# EasyEDA Pro project ProPrj_esp32天气时钟与SD卡MP3播放_2026-06-30.epro

# Schematic Schematic1
Create Date: 2023-12-25; Page Name: P1; Project Name: esp32天气时钟与SD卡MP3播放; Schematic Name: Schematic1; Update Date: 2023-12-25; Company: 嘉立创EDA; Page Size: A4; Version: V1.0
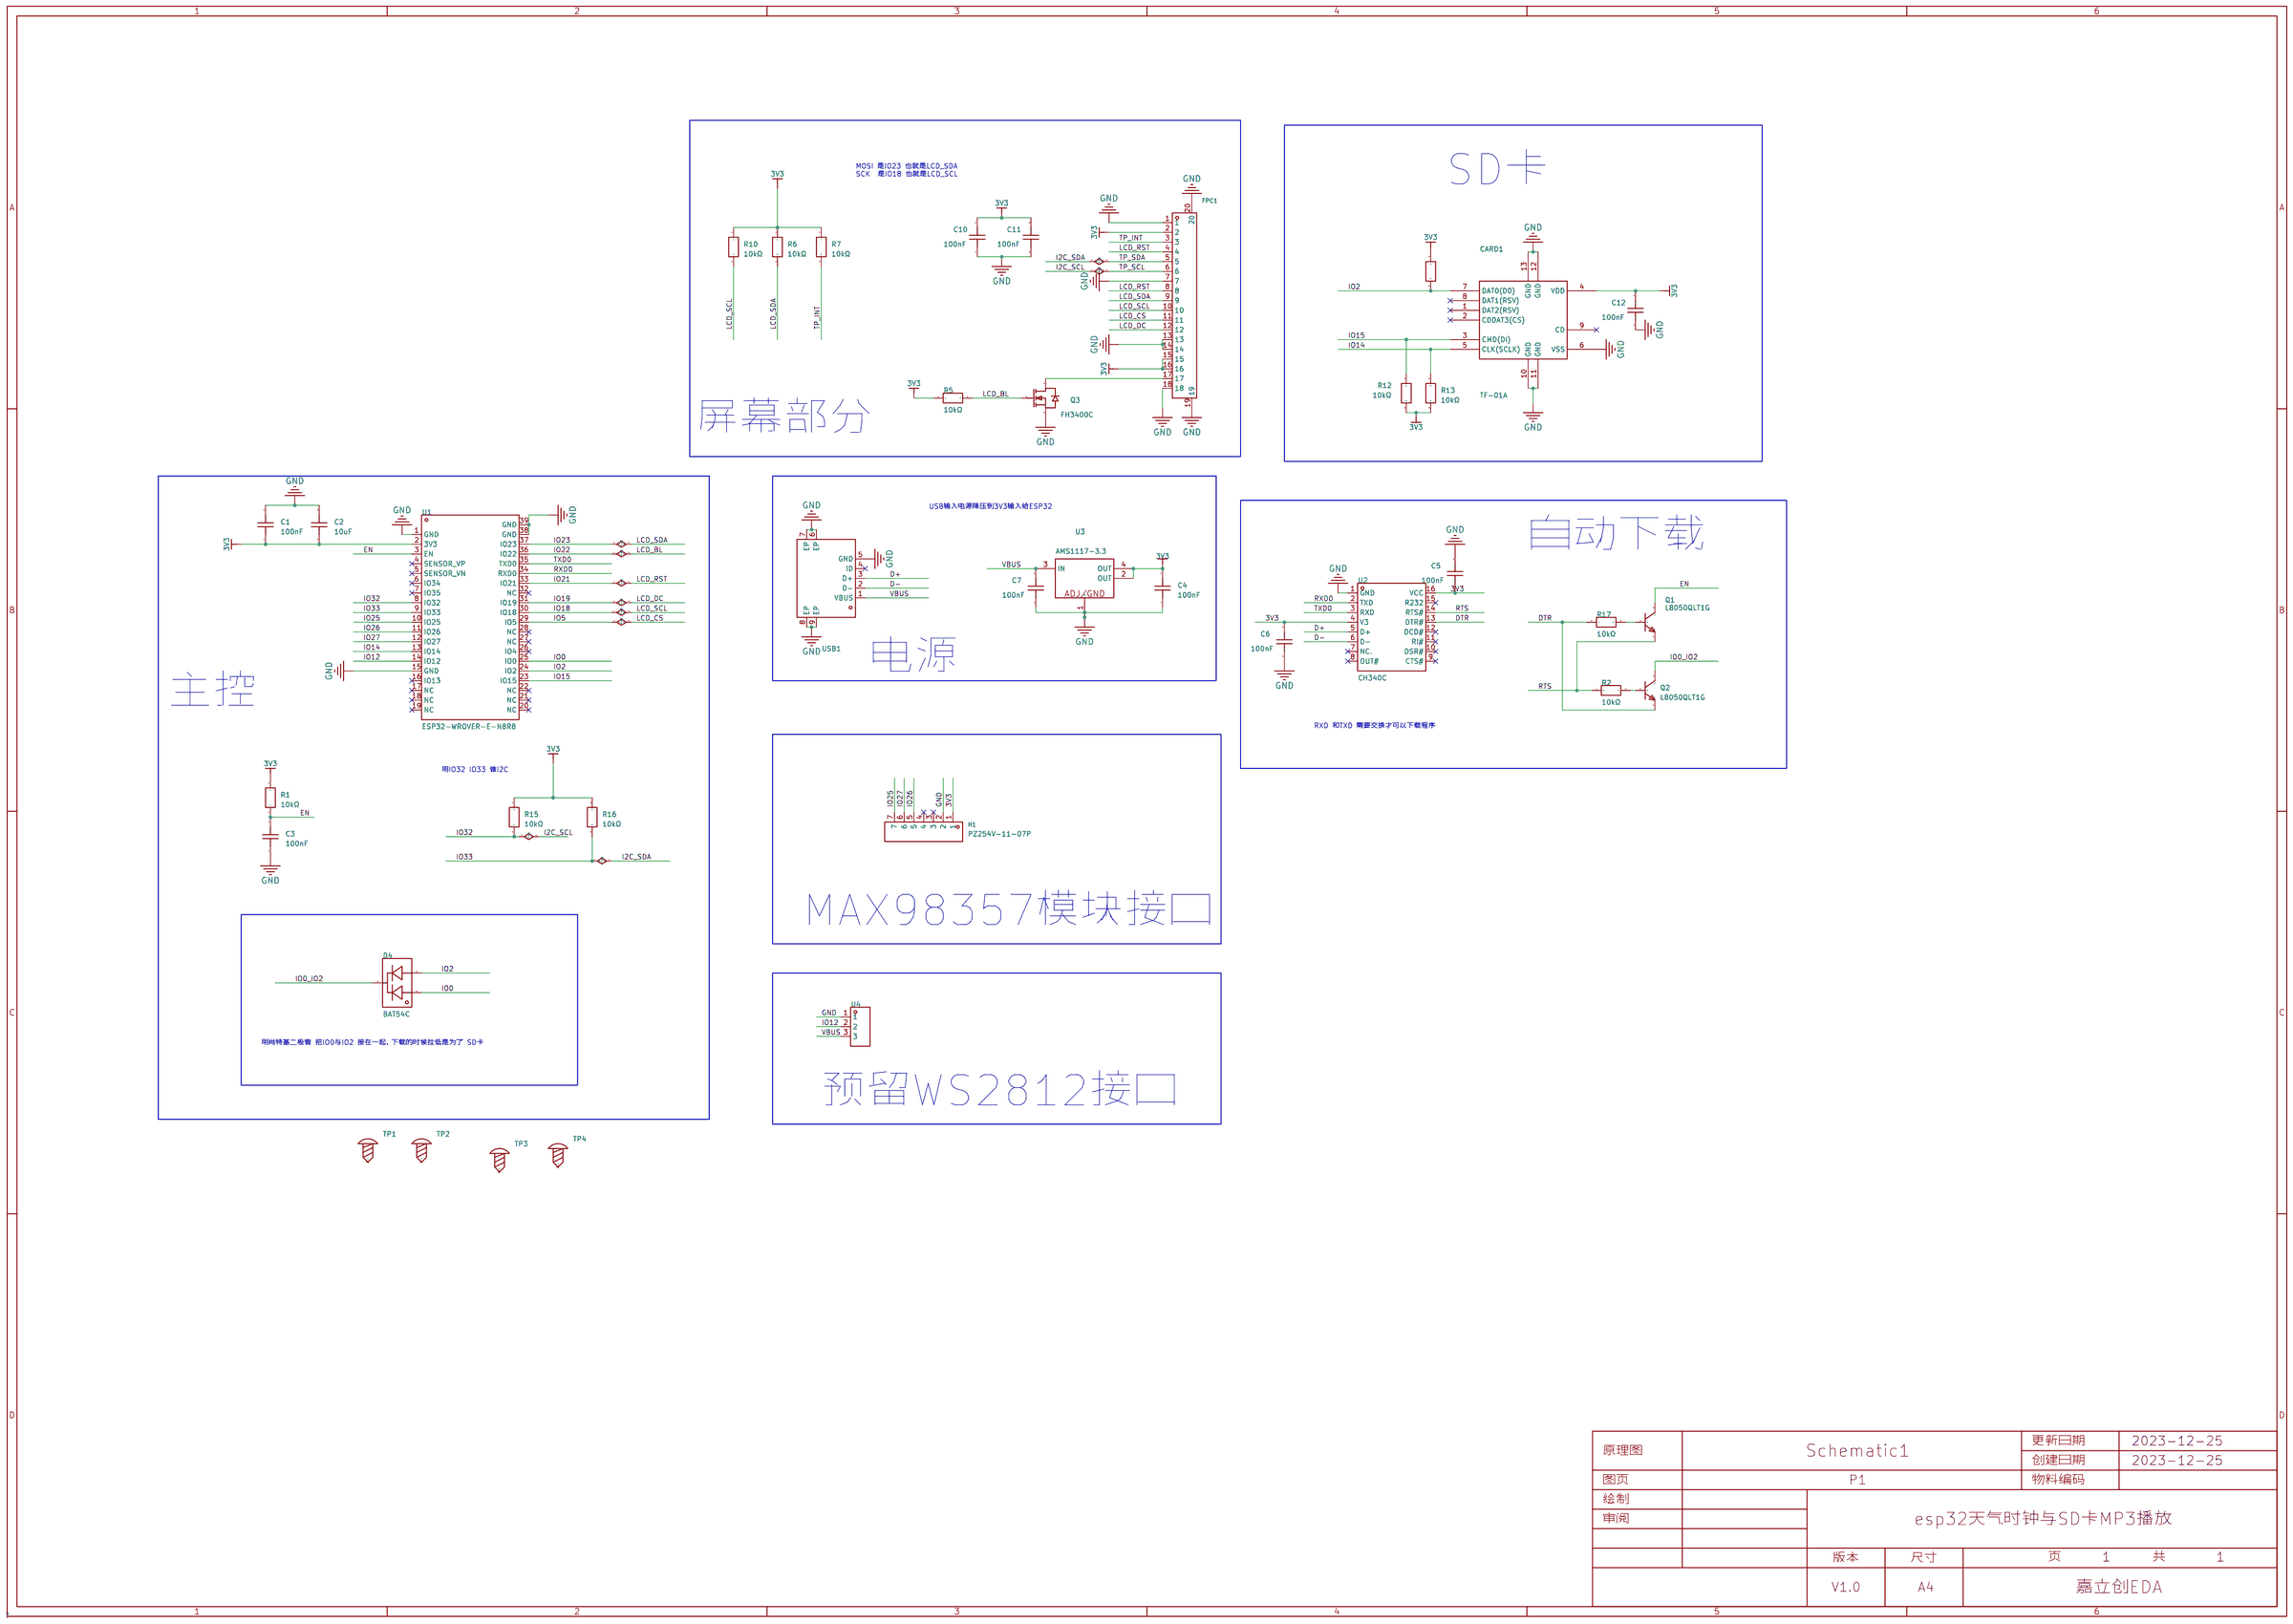
[diagram p0: schematic sheet]

## Parts
C1  100nF  [C0603]
C2  10uF  [C0603]
C3  100nF  [C0603]
C4  100nF  [C0603]
C5  100nF  [C0603]
C6  100nF  [C0603]
C7  100nF  [C0603]
C10  100nF  [C0603]
C11  100nF  [C0603]
C12  100nF  [C0603]
CARD1  TF-01A  [TF-SMD_TF-01A]
D4  BAT54C  [SOT-23-3_L2.9-W1.4-P1.91-LS2.6-BR]
FPC1  X05A15L18T  [FFC-SMD_18P-P0.50_X05A15L18T]
H1  PZ254V-11-07P  [HDR-TH_7P-P2.54-V-M]
Q1  L8050QLT1G  [SOT-23-3_L2.9-W1.3-P1.90-LS2.4-BR]
Q2  L8050QLT1G  [SOT-23-3_L2.9-W1.3-P1.90-LS2.4-BR]
Q3  FH3400C  [SOT-23-3_L2.9-W1.3-P1.90-LS2.4-BR]
R1  10kΩ  [R0805]
R2  10kΩ  [R0805]
R5  10kΩ  [R0805]
R6  10kΩ  [R0805]
R7  10kΩ  [R0805]
R10  10kΩ  [R0805]
R11  10kΩ  [R0805]
R12  10kΩ  [R0805]
R13  10kΩ  [R0805]
R15  10kΩ  [R0805]
R16  10kΩ  [R0805]
R17  10kΩ  [R0805]
TP1  -  [M3螺丝]
TP2  -  [M3螺丝]
TP3  -  [M3螺丝]
TP4  -  [M3螺丝]
U1  ESP32-WROVER-E-N8R8  [WIFI-SMD_ESP32-WROVER-IE8MB]
U2  CH340C  [SOP-16_L10.0-W3.9-P1.27-LS6.0-BL]
U3  AMS1117-3.3  [SOT-223-3_L6.4-W3.5-P2.30-LS7.0-BR]
U4  HDGC2001WR-3P  [CONN-TH_3P-P2.00_HDGC_HDGC2001WR-3P]
USB1  U-F-M5DD-Y-2  [MICRO-USB-SMD_U-F-M5DD-Y-2-1]

## Library data of the parts
C1 C3 = CL10B104KB8NNNC: 容值:100nF;精度:±10%;额定电压:50V;材质(温度系数):X7R;; LCSC Part Name: 100nF ±10% 50V; Supplier Part: C1591; Manufacturer: SAMSUNG(三星); Supplier Footprint: 0603; Datasheet: https://atta.szlcsc.com/upload/public/pdf/source/20160218/1457707763339.pdf; Supplier: LCSC; Tolerance: ±10%; Voltage Rated: 50V; Temperature Coefficient: X7R
C2 = CL10A106MQ8NNNC: 容值:10uF;精度:±20%;额定电压:6.3V;材质(温度系数):X5R;; LCSC Part Name: 10uF ±20% 6.3V; Supplier Part: C1691; Manufacturer: SAMSUNG(三星); Supplier Footprint: 0603; Datasheet: https://atta.szlcsc.com/upload/public/pdf/source/20160218/1457707763339.pdf; Supplier: LCSC; Tolerance: ±20%; Voltage Rated: 6.3V; Temperature Coefficient: X5R
C4-C7 C10-C12 = CC0603KRX7R9BB104: 容值:100nF;精度:±10%;额定电压:50V;材质(温度系数):X7R;; LCSC Part Name: 100nF ±10% 50V; Supplier Part: C14663; Manufacturer: YAGEO(国巨); Supplier Footprint: 0603; JLCPCB Part Class: Basic Part; Datasheet: https://atta.szlcsc.com/upload/public/pdf/source/20170116/1484561234239.pdf; Supplier: LCSC; Tolerance: ±10%; Voltage Rated: 50V; Temperature Coefficient: X7R
CARD1 = TF-01A_C91145: 工作温度范围:-;本体最大高度:-;触头镀层:-;连接器类型:卡座;卡类型:MicroSD卡(TF卡);焊接温度(最大值):-;触头材质:-;卡连接方式:自弹式;; Supplier Part: C91145; Manufacturer: 韩国韩荣; Supplier Footprint: SMD; Datasheet: https://atta.szlcsc.com/upload/public/pdf/source/20190322/C91145_63CBD6FB4639A3A3EC6A9721F18AE0FB.pdf; Supplier: LCSC; Connector Type: 卡座; Card Type: MicroSD卡(TF卡); Card Connection Mode: 自弹式
D4 = BAT54C_C727125: 二极管配置:1对共阴极;直流反向耐压(Vr):30V;平均整流电流(Io):200mA;正向压降(Vf):1V@100mA;反向电流(Ir):2uA@25V;; LCSC Part Name: 30V 200mA 1V@100mA; Supplier Part: C727125; Manufacturer: TWGMC(台湾迪嘉); Supplier Footprint: SOT-23; Datasheet: https://atta.szlcsc.com/upload/public/pdf/source/20200827/C727125_FA9D830E6485A4AEFAD08726CE8D43AC.pdf; Supplier: LCSC; Diode Configuration: 1对共阴极; Reverse Voltage (Vr): 30V; Average Rectified Current (Io): 200mA; Forward Voltage (Vf@If): 1V@100mA; Reverse Leakage Current (Ir): 2uA@25V
FPC1 = X05A15L18T: 间距:0.5mm;触点数量:18;锁定特性:翻盖式;安装类型:卧贴;触点类型:下接;工作温度范围:-25℃~+85℃;焊接温度(最大值):260℃;; LCSC Part Name: 0.5mm P数:18 翻盖式 下接 镀锡; Supplier Part: C437037; Manufacturer: XKB Connectivity(中国星坤); Supplier Footprint: SMD,P=0.5mm; Supplier: LCSC; Pitch: 0.5mm; Number of Contacts: 18; Locking Feature: 翻盖式; Mounting Type: 卧贴; Contact Type: 下接; Height Above Board: 1.5mm; FFC, FCB Thickness: 0.3mm; Contact Material: 铜合金; Contact Plating: 锡; Operating Temperature Range: -25℃~+85℃; Welding Temperature (Max): 260℃
H1 = PZ254V-11-07P: 排数:单排;总PIN位数:7P;间距:2.54mm;插针结构:1x7P;行距:-;安装类型:直插;圆针/方针:方针;额定电流:-;额定电压:-;配合针长度:6mm;塑高:2.5mm;端接针长度:3mm;触头材质:黄铜;触头镀层:-;工作温度范围:-40℃~+105℃;颜色:黑色;; LCSC Part Name: 2.54mm 1x7P 直插 方针; Supplier Part: C492406; Manufacturer: XFCN(兴飞); Supplier Footprint: 插件,P=2.54mm; JLCPCB Part Class: 扩展库; Datasheet: https://atta.szlcsc.com/upload/public/pdf/source/20200309/C492406_654C533EE691117E22DD9F76C114C2D9.pdf; Supplier: LCSC; Number of Rows: 单排; Number of Pins: 7P; Pitch: 2.54mm; Pin Structure: 1x7P; Mounting Type: 直插; Circluar Pins/Square Pins: 方针; Length of Mating Pin: 6mm; Insulation Height: 2.5mm; Length of End Connection Pin: 3mm; Contact Material: 黄铜; Operating Temperature Range: -40℃~+105℃; Color: 黑色
Q1 Q2 = L8050QLT1G: 晶体管类型:NPN;集射极击穿电压(Vceo):25V;集电极电流(Ic):800mA;功率(Pd):225mW;; LCSC Part Name: NPN 耐压:25V 电流:800mA; Supplier Part: C49581; Manufacturer: LRC(乐山无线电); Supplier Footprint: SOT-23; Datasheet: https://atta.szlcsc.com/upload/public/pdf/source/20150518/1457707314424.pdf; Supplier: LCSC; Transistor Type: NPN; Collector-Emitter Breakdown Voltage (Vceo): 25V; Collector Current (Ic): 800mA; Power Dissipation (Pd): 225mW
Q3 = FH3400C: LCSC Part Name: NMOS; Supplier Part: C2940037; Manufacturer: 鑫飞宏; Supplier Footprint: SOT-23; Datasheet: https://atta.szlcsc.com/upload/public/pdf/source/20220104/F9C168DB7EB2E0C5477F24B8ADDCAFBA.pdf; Supplier: LCSC
R1 R2 R5-R7 R10-R13 R15-R17 = FRC0805J103TS: 阻值:10kΩ;精度:±5%;功率:125mW;温度系数:±100ppm/℃;电阻类型:厚膜电阻;; LCSC Part Name: 10kΩ ±5% 125mW 厚膜电阻; Supplier Part: C2930231; Manufacturer: FOJAN(富捷); Supplier Footprint: 0805; Datasheet: https://atta.szlcsc.com/upload/public/pdf/source/20211221/925EC7D7225764EE0046F22065062C87.pdf; Supplier: LCSC; Tolerance: ±5%; Power(Watts): 125mW; Overload Voltage (Max): 150V; Temperature Coefficient: ±100ppm/℃; Type: 厚膜电阻; Operating Temperature Range: -55℃~+155℃
TP1-TP4 = M3螺丝: Supplier Footprint: 插件
U1 = ESP32-WROVER-E-N8R8: LCSC Part Name: 通用型Wi-Fi+BT+BLE MCU模组; Supplier Part: C2973667; Manufacturer: ESPRESSIF(乐鑫); Supplier Footprint: SMD,18x31.4mm; JLCPCB Part Class: 扩展库; Datasheet: https://atta.szlcsc.com/upload/public/pdf/source/20220705/4CA9CAE4F1CD09508C2EE2DEF6FA5017.pdf; Supplier: LCSC
U2 = CH340C: 应用功能:收发器;接口协议:USB 2.0;数据速率:2Mbps;; LCSC Part Name: CH340C USB转串口芯片 CH340; Supplier Part: C84681; Manufacturer: WCH(南京沁恒); Supplier Footprint: SOP-16; Datasheet: https://atta.szlcsc.com/upload/public/pdf/source/20200819/C84681_ADBED554CE321879DBD6B1D06488689C.pdf; Supplier: LCSC; Applications Function: 收发器; Protocol: USB 2.0; Data Rate: 2Mbps; Supply Voltage: 3.3V；5V
U3 = AMS1117-3.3_C2992570: Supplier Part: C2992570; Manufacturer: 国芯佳品; Supplier Footprint: SOT-223-3; JLCPCB Part Class: Extended Part; Datasheet: https://atta.szlcsc.com/upload/public/pdf/source/20220729/0D21C21EC310E4778671BF6BAE438640.pdf; Supplier: LCSC
U4 = HDGC2001WR-3P: LCSC Part Name: PH2.0弯针 3P; Supplier Part: C5175240; Manufacturer: HDGC(华德共创); Supplier Footprint: 弯插,P=2mm; JLCPCB Part Class: 扩展库; Datasheet: https://atta.szlcsc.com/upload/public/pdf/source/20220916/36534CA64A2134C65DEF28B604EC5CCB.pdf; Supplier: LCSC
USB1 = U-F-M5DD-Y-2: 连接器类型:Micro-B;标准:USB 2.0;公母:母;触点数量:5P;端口数量:1;安装方式:卧贴;额定电流 - 电源:1A;工作温度范围:-;; LCSC Part Name: Micro-B 母 卧贴; Supplier Part: C2689949; Manufacturer: 韩国韩荣; Supplier Footprint: SMD; Datasheet: https://atta.szlcsc.com/upload/public/pdf/source/20210322/C2689949_86876C80FB813C0122F4FEFC65AEF6C8.pdf; Supplier: LCSC; Connector Type: Micro-B; Standard: USB 2.0; Gender: 母; Number of Contacts: 5P; Number of Ports: 1; Mounting Style: 卧贴; Current Rating - Power (Max): 1A

## Nets
3V3: C1.1 C2.1 C4.2 C5.1 C6.2 C10.2 C11.2 C12.2 CARD1.4(VDD) FPC1.2 FPC1.15 FPC1.16 H1.1 R1.2 R5.2 R6.1 R7.1 R10.1 R11.1 R12.2 R13.2 R15.1 R16.1 U1.2(3V3) U2.4(V3) U2.16(VCC) U3.2(OUT) U3.4(OUT)
GND: C1.2 C2.2 C3.1 C4.1 C5.2 C6.1 C7.1 C10.1 C11.1 C12.1 CARD1.6(VSS) CARD1.10(GND) CARD1.11(GND) CARD1.12(GND) CARD1.13(GND) FPC1.1 FPC1.7 FPC1.13 FPC1.14 FPC1.18 FPC1.19 FPC1.20 H1.2 Q3.2(S) U1.1(GND) U1.15(GND) U1.38(GND) U1.39(GND) U2.1(GND) U3.1(ADJ/GND) U4.1 USB1.5(GND) USB1.6(EP) USB1.7(EP) USB1.8(EP) USB1.9(EP)
VBUS: C7.2 U3.3(IN) U4.3 USB1.1(VBUS)
D+: U2.5(D+) USB1.3(D+)
D-: U2.6(D-) USB1.2(D-)
DTR: Q2.2(E) R17.1 U2.13(DTR#)
EN: C3.2 Q1.3(C) R1.1 U1.3(EN)
I2C_SCL: FPC1.6 R15.2 U1.8(IO32)
I2C_SDA: FPC1.5 R16.2 U1.9(IO33)
IO0: D4.1 U1.25(IO0)
IO0_IO2: D4.3 Q2.3(C)
IO2: CARD1.7(DAT0(D0)) D4.2 R11.2 U1.24(IO2)
IO5: FPC1.11 U1.29(IO5)
IO12: U1.14(IO12) U4.2
IO14: CARD1.5(CLK(SCLK)) R13.1 U1.13(IO14)
IO15: CARD1.3(CMD(DI)) R12.1 U1.23(IO15)
IO18: FPC1.10 R10.2 U1.30(IO18)
IO19: FPC1.12 U1.31(IO19)
IO21: FPC1.4 FPC1.8 U1.33(IO21)
IO22: Q3.1(G) R5.1 U1.36(IO22)
IO23: FPC1.9 R6.2 U1.37(IO23)
IO25: H1.7 U1.10(IO25)
IO26: H1.5 U1.11(IO26)
IO27: H1.6 U1.12(IO27)
RTS: Q1.2(E) R2.1 U2.14(RTS#)
RXD0: U1.34(RXD0) U2.2(TXD)
TP_INT: FPC1.3 R7.2
TXD0: U1.35(TXD0) U2.3(RXD)
$1N3592: Q1.1(B) R17.2
$1N3593: Q2.1(B) R2.2
$1N3615: FPC1.17 Q3.3(D)

Not connected (* = marked no-connect by the designer): CARD1 1(DAT2(RSV))* 2(CDDAT3(CS))* 8(DAT1(RSV))* 9(CD)*; H1 3* 4*; TP1 1; TP2 1; TP3 1; TP4 1; U1 4(SENSOR_VP)* 5(SENSOR_VN)* 6(IO34)* 7(IO35)* 16(IO13)* 17(NC)* 18(NC)* 19(NC)* 20(NC)* 21(NC)* 22(NC)* 26(IO4)* 27(NC)* 28(NC)* 32(NC)*; U2 7(NC.)* 8(OUT#)* 9(CTS#)* 10(DSR#)* 11(RI#)* 12(DCD#)* 15(R232)*; USB1 4(ID)*

## Notes on the sheet
- MOSI 是IO23 也就是LCD_SDA
  SCK  是IO18 也就是LCD_SCL
- SD卡
- 屏幕部分
- USB输入电源降压到3V3输入给ESP32
- 自动下载
- 电源
- 主控
- RXD 和TXD 需要交换才可以下载程序
- 用IO32 IO33 做I2C
- MAX98357模块接口
- 用肖特基二极管 把IO0与IO2 接在一起，下载的时候拉低是为了 SD卡
- 预留WS2812接口

# Board PCB1_3
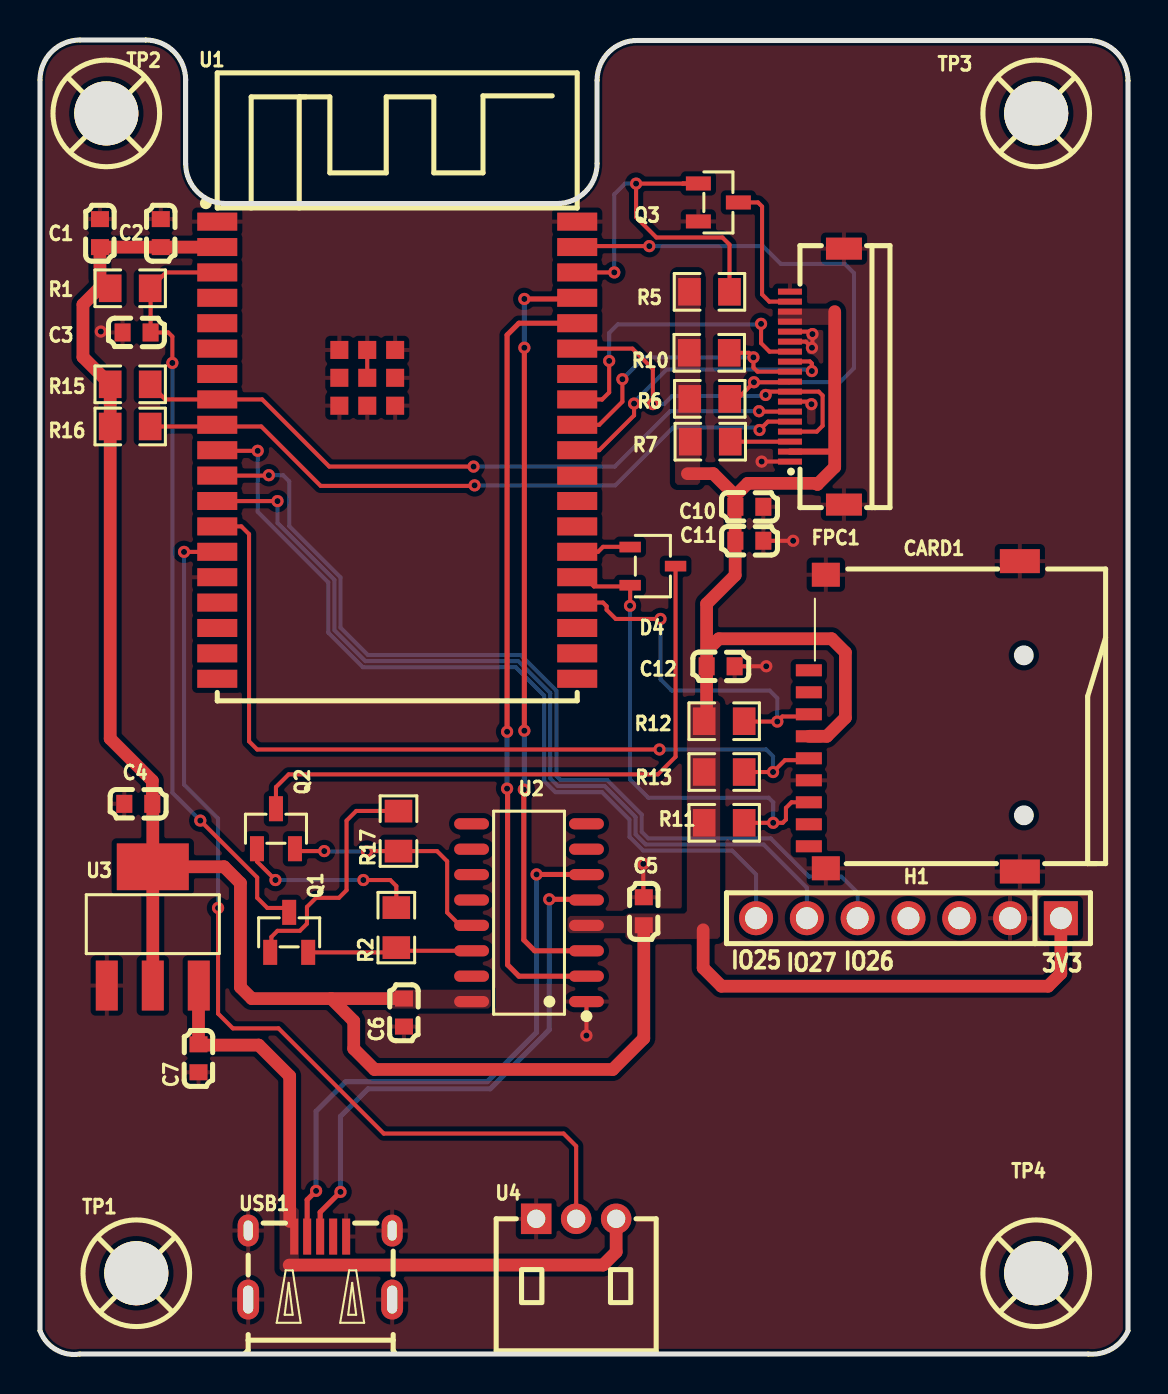
[diagram p1: board, top side]
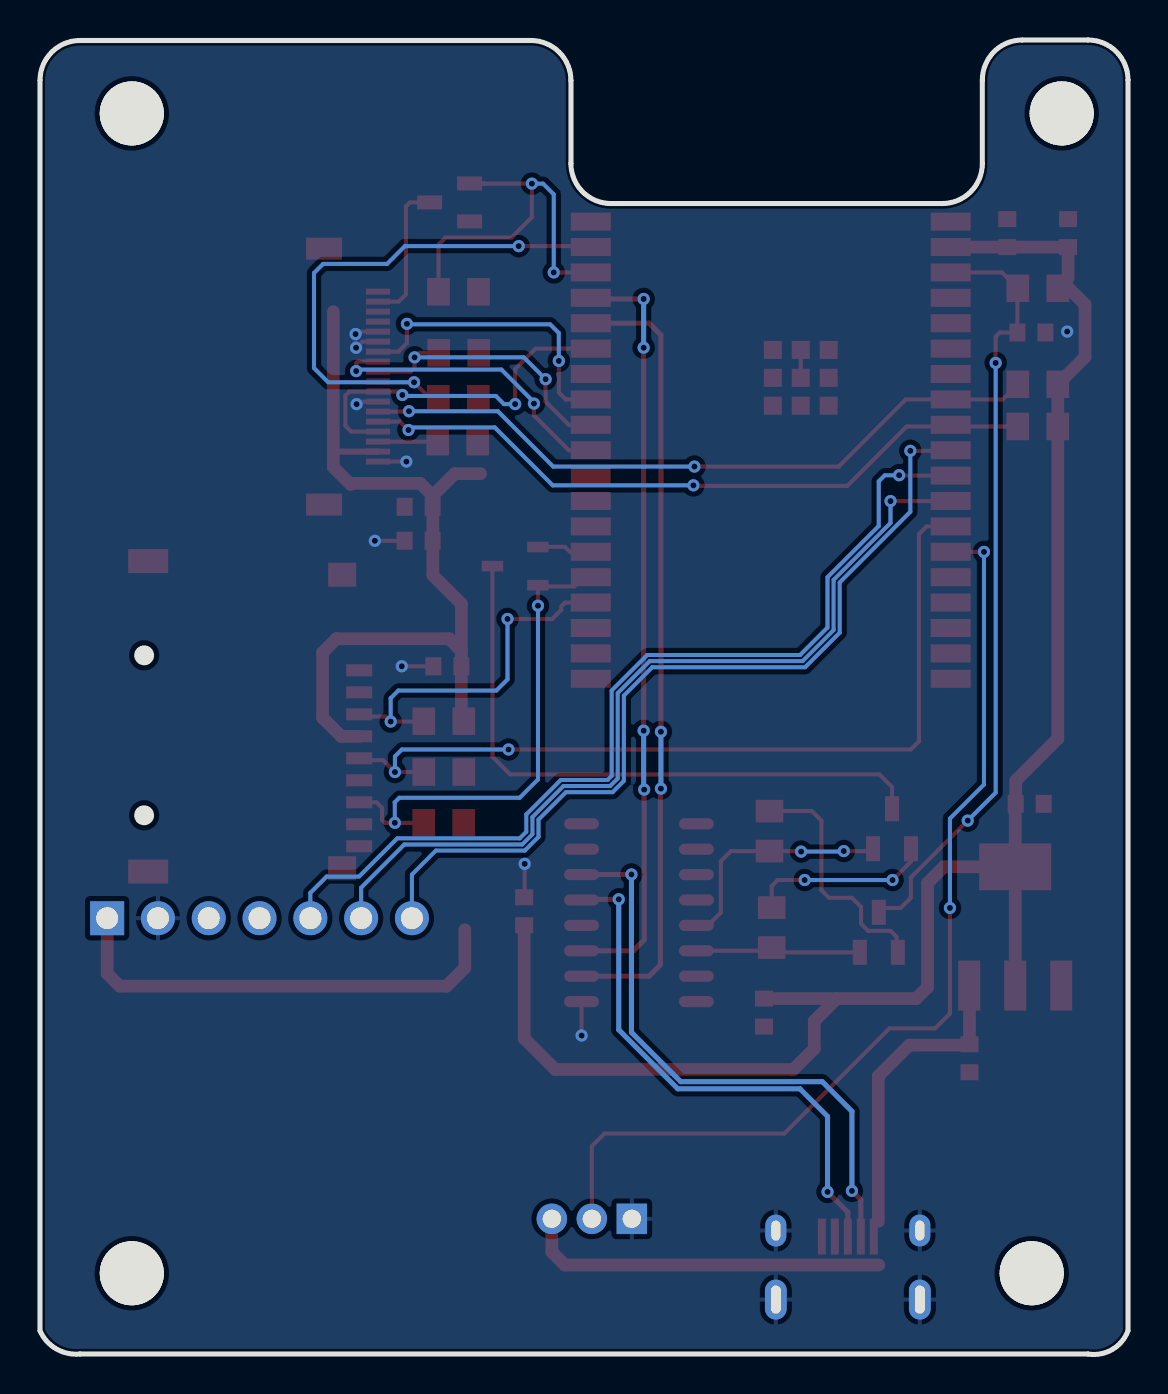
[diagram p2: board, bottom side, seen from below]

Outline 54.41 x 65.71 mm; copper layers: Top Layer, Bottom Layer. Coordinates in mm from the lower left corner of the outline.
Outline path: 0,63.71 arc(0.59,65.12) 2,65.71 5.28,65.71 arc(6.7,65.12) 7.28,63.71 7.28,59.53 arc(7.87,58.12) 9.28,57.53 25.86,57.53 arc(27.27,58.12) 27.86,59.53 27.86,63.68 arc(28.44,65.1) 29.86,65.68 52.41,65.68 arc(53.82,65.1) 54.41,63.68 54.41,1.16 arc(53.59,0.26) 52.41,0 2,0 arc(0.79,0.22) 0,1.16 0,63.71
Stack: Top Layer 0.035mm / Dielectric1 1.51mm FR4 er 4.5 / Bottom Layer 0.035mm

## Design rules (mm)
spacing copperThickness1oz (default): track to track 0.102, other pairs 0.152 to 0.3
spacing copperThickness2oz: track to track 0.203, other pairs 0.152 to 0.3
spacing Plane_innerPlane: track to track 0.102, other pairs 0.152 to 0.3
spacing Copper_copperRegion: track to track 0.102, other pairs 0.152 to 0.3
track width copperThickness1oz (default): min 0.127, default 0.254, max 2.54
track width copperThickness2oz: min 0.203, default 0.254, max 2.54
differential pair differentialPair (default): width min 0.127, default 0.254, max 2.54; gap min 0.152, default 0.152
pour e442 uses Copper_copperRegion
pour e468 uses Copper_copperRegion

## Placement (name value [footprint] x y rotation side)
C1  100nF  [C0603]  3 56.05 90 top
C2  10uF  [C0603]  6.04 56.05 90 top
C3  100nF  [C0603]  4.83 51.08 0 top
C4  100nF  [C0603]  4.92 27.51 0 top
C5  100nF  [C0603]  30.19 22.14 90 top
C6  100nF  [C0603]  18.2 17.07 90 top
C7  100nF  [C0603]  7.93 14.79 90 top
C10  100nF  [C0603]  35.47 42.37 180 top
C11  100nF  [C0603]  35.47 40.67 180 top
C12  100nF  [C0603]  34.04 34.39 180 top
CARD1  TF-01A  [TF-SMD_TF-01A]  43.72 31.89 90 top
D4  BAT54C  [SOT-23-3_L2.9-W1.4-P1.91-LS2.6-BR]  30.65 39.4 180 top
FPC1  X05A15L18T  [FFC-SMD_18P-P0.50_X05A15L18T]  38.85 48.88 90 top
H1  PZ254V-11-07P  [HDR-TH_7P-P2.54-V-M]  43.43 21.79 180 top
Q1  L8050QLT1G  [SOT-23-3_L2.9-W1.3-P1.90-LS2.4-BR]  12.46 21.09 270 top
Q2  L8050QLT1G  [SOT-23-3_L2.9-W1.3-P1.90-LS2.4-BR]  11.8 26.27 270 top
Q3  FH3400C  [SOT-23-3_L2.9-W1.3-P1.90-LS2.4-BR]  33.92 57.59 180 top
R1  10kΩ  [R0805]  4.51 53.29 180 top
R2  10kΩ  [R0805]  17.82 21.32 90 top
R5  10kΩ  [R0805]  33.48 53.12 180 top
R6  10kΩ  [R0805]  33.49 47.76 0 top
R7  10kΩ  [R0805]  33.52 45.62 0 top
R10  10kΩ  [R0805]  33.47 50.07 0 top
R11  10kΩ  [R0805]  34.21 26.56 0 top
R12  10kΩ  [R0805]  34.21 31.64 180 top
R13  10kΩ  [R0805]  34.21 29.1 180 top
R15  10kΩ  [R0805]  4.51 48.49 0 top
R16  10kΩ  [R0805]  4.51 46.38 0 top
R17  10kΩ  [R0805]  17.93 26.15 90 top
TP1  -  [M3螺丝]  4.88 3.97 0 top
TP2  -  [M3螺丝]  3.38 61.97 0 top
TP3  -  [M3螺丝]  49.88 61.97 0 top
TP4  -  [M3螺丝]  49.88 3.97 0 top
U1  ESP32-WROVER-E-N8R8  [WIFI-SMD_ESP32-WROVER-IE8MB]  17.86 45.2 0 top
U2  CH340C  [SOP-16_L10.0-W3.9-P1.27-LS6.0-BL]  24.45 22.07 90 top
U3  AMS1117-3.3  [SOT-223-3_L6.4-W3.5-P2.30-LS7.0-BR]  5.64 21.39 270 top
U4  HDGC2001WR-3P  [CONN-TH_3P-P2.00_HDGC_HDGC2001WR-3P]  26.81 6.76 0 top
USB1  U-F-M5DD-Y-2  [MICRO-USB-SMD_U-F-M5DD-Y-2-1]  14.01 4.45 0 top

## Footprints (pads in the part's own frame, mm; a bottom-side part is the same pattern mirrored in y, then rotated)
C0603
  rect 0.8x0.9 smd: 1(-0.7,0) 2(0.7,0)
CONN-TH_3P-P2.00_HDGC_HDGC2001WR-3P
  rect 1.524x1.524 hole 0.914: 1(-2,0)
  round 1.524 hole 0.914: 2(0,0) 3(2,0)
FFC-SMD_18P-P0.50_X05A15L18T
  rect 0.3x1.2 smd: 1(-4.25,1.35) 2(-3.75,1.35) 3(-3.25,1.35) 4(-2.75,1.35) 5(-2.25,1.35) 6(-1.75,1.35) 7(-1.25,1.35) 8(-0.75,1.35) 9(-0.25,1.35) 10(0.25,1.35) 11(0.75,1.35) 12(1.25,1.35) 13(1.75,1.35) 14(2.25,1.35) 15(2.75,1.35) 16(3.25,1.35) 17(3.75,1.35) 18(4.25,1.35)
  rect 1.1x1.8 smd: 19(6.4,-1.35) 20(-6.4,-1.35)
HDR-TH_7P-P2.54-V-M
  rect 1.7x1.7 hole 1.1: 1(-7.62,0)
  round 1.7 hole 1.1: 2(-5.08,0) 3(-2.54,0) 4(0,0) 5(2.54,0) 6(5.08,0) 7(7.62,0)
M3螺丝
  round 3.2 hole 3.2: 1(-0.064,0.064)
MICRO-USB-SMD_U-F-M5DD-Y-2-1
  rect 0.4x1.8 smd: 1(-1.3,1.423) 2(-0.65,1.423) 3(0,1.423) 4(0.65,1.423) 5(1.3,1.423)
  oval 1.05x1.6 hole 0.45x1: 6(3.6,1.723) 7(-3.6,1.727)
  oval 1.09x2 hole 0.5x1.4: 8(-3.6,-1.727) 9(3.6,-1.727)
R0805
  rect 1.133x1.377 smd: 1(-1,0) 2(1,0)
SOP-16_L10.0-W3.9-P1.27-LS6.0-BL
  oval 0.56x1.745 smd: 1(-4.445,-2.873) 2(-3.175,-2.873) 3(-1.905,-2.873) 4(-0.635,-2.873) 5(0.635,-2.873) 6(1.905,-2.873) 7(3.175,-2.873) 8(4.445,-2.873) 9(4.445,2.873) 10(3.175,2.873) 11(1.905,2.873) 12(0.635,2.873) 13(-0.635,2.873) 14(-1.905,2.873) 15(-3.175,2.873) 16(-4.445,2.873)
SOT-23-3_L2.9-W1.3-P1.90-LS2.4-BR
  rect 1.25x0.7 smd: 1(1,-0.95) 2(1,0.95) 3(-1,0)
SOT-23-3_L2.9-W1.4-P1.91-LS2.6-BR
  rect 1.07x0.532 smd: 1(1.135,-0.955) 2(1.135,0.955) 3(-1.135,0)
SOT-223-3_L6.4-W3.5-P2.30-LS7.0-BR
  rect 2.5x1.1 smd: 1(2.97,-2.3) 2(2.97,0) 3(2.97,2.3)
  rect 2.34x3.6 smd: 4(-2.97,0)
TF-SMD_TF-01A
  rect 0.6x1.3 smd: 1(2.3,5.276) 2(1.2,5.276) 3(0.101,5.276) 4(-1,5.276) 5(-2.099,5.276) 6(-3.2,5.276) 7(-4.3,5.276) 8(-5.399,5.276) 9(-6.5,5.276)
  rect 1.2x1.4 smd: 10(-7.599,4.426) 13(7.08,4.426)
  rect 1.2x2 smd: 11(-7.76,-5.276) 12(7.76,-5.276)
WIFI-SMD_ESP32-WROVER-IE8MB
  rect 2x0.9 smd: 1(-9,11.43) 2(-9,10.16) 3(-9,8.89) 4(-9,7.62) 5(-9,6.35) 6(-9,5.08) 7(-9,3.81) 8(-9,2.54) 9(-9,1.27) 10(-9,0) 11(-9,-1.27) 12(-9,-2.54) 13(-9,-3.81) 14(-9,-5.08) 15(-9,-6.35) 16(-9,-7.62) 17(-9,-8.89) 18(-9,-10.16) 19(-9,-11.43) 20(9,-11.43) 21(9,-10.16) 22(9,-8.89) 23(9,-7.62) 24(9,-6.35) 25(9,-5.08) 26(9,-3.81) 27(9,-2.54) 28(9,-1.27) 29(9,0) 30(9,1.27) 31(9,2.54) 32(9,3.81) 33(9,5.08) 34(9,6.35) 35(9,7.62) 36(9,8.89) 37(9,10.16) 38(9,11.43)
  rect 0.9x0.9 smd: 39(-2.895,5.015) 39(-2.895,3.62) 39(-2.895,2.225) 39(-1.5,5.015) 39(-1.5,3.62) 39(-1.5,2.225) 39(-0.105,5.015) 39(-0.105,3.62) 39(-0.105,2.225)

## Nets
As in the schematic.

Pads without a net: CARD1 1 2 8 9; H1 3 4; TP1 1; TP2 1; TP3 1; TP4 1; U1 4 5 6 7 16 17 18 19 20 21 22 26 27 28 32; U2 7 8 9 10 11 12 15; USB1 4

## Via types
v1: diameter 0.61, hole 0.305, Top Layer to Bottom Layer, 52 vias

## Routing (per net, layer and track width the routed paths; a pad name or vN(x,y) marks a point on that pad's centre or on a via; arc(x,y) is an arc through that point)
3V3: length 154.4
  Top Layer w0.305: 39.74,45.17 39.7,45.13 FPC1.2
  Top Layer w0.635: 32.37,44.02 33.67,44.02 34.77,42.92 ; U1.2 8.86,55.35 C2.1 C1.1 3,53.81 R1.2 2.96,53.29 2.15,52.48 2.15,49.85 R15.1 R16.1 3.51,30.77 5.62,28.67 C4.2 5.64,27.49 U3.4 ; U3.4 U3.2 ; U3.4 9.21,24.36 10.02,23.55 10.02,18.34 10.59,17.77 14.56,17.77 ; 14.56,17.77 C6.2 ; 14.56,17.77 15.69,16.65 15.69,15.27 16.73,14.23 28.64,14.23 30.19,15.78 C5.1 ; H1.1 51.05,19.03 50.41,18.39 34.08,18.39 33.16,19.31 33.16,21.21 ; R12.2 33.34,31.77 C12.2 33.34,35.16 ; 34.77,42.92 C10.2 34.76,42.36 34.76,38.94 33.34,37.52 33.34,35.16 ; 34.77,42.92 35.39,43.54 38.83,43.54 38.88,43.49 39.74,44.35 39.74,52.12 ; 33.34,35.16 33.95,35.77 39.59,35.77 40.27,35.08 40.27,31.82 39.34,30.89 38.45,30.89
GND: length 13.5
  Top Layer w0.203: FPC1.14 38.5,51.13 v1(38.63,51) 38.63,50.34 v1(38.6,50.32) 38.29,50.63 FPC1.13 ; FPC1.7 38.45,47.63 v1(38.58,47.5) ; C12.1 36.31,34.39 v1(36.32,34.39) ; v1(37.66,40.67) 36.18,40.67 C11.1 ; v1(30.17,24.51) 30.17,22.87 C5.2 ; v1(27.32,15.93) 27.33,15.93 U2.1 ; v1(36.09,44.63) 37.5,44.63 ; U1.39 U1.39
  vias: v1(3.04,51.13)
VBUS: length 33.7
  Top Layer w0.635: 12.46,4.45 28.16,4.45 28.81,5.1 U4.3 ; 12.49,6.63 12.49,13.9 10.94,15.45 7.97,15.45 C7.2 7.93,18.41 U3.3
D+: length 27.1
  Top Layer w0.254: U2.5 27.29,22.74 v1(25.47,22.74) ; USB1.3 14.01,7.09 v1(15.03,8.11)
  Bottom Layer w0.254: v1(15.03,8.11) 15.03,11.88 16.41,13.26 22.51,13.26 25.47,16.21 v1(25.47,22.74)
D-: length 29.5
  Top Layer w0.254: v1(24.83,23.98) 27.32,23.98 U2.6 ; v1(13.81,8.16) 13.36,7.71 USB1.2
  Bottom Layer w0.254: v1(24.83,23.98) 24.83,16.08 22.37,13.62 15.29,13.62 13.81,12.14 v1(13.81,8.16)
DTR: length 11.9
  Top Layer w0.203: v1(14.21,25.15) 12.87,25.15 Q2.2 ; U2.13 21,21.43 20.36,22.08 20.36,24.64 19.85,25.15 R17.1 16.37,25.15 v1(16.35,25.12)
  Bottom Layer w0.203: v1(16.35,25.12) 14.24,25.12 v1(14.21,25.15)
EN: length 38.8
  Top Layer w0.203: v1(8.02,26.67) 10.86,23.83 10.86,22.81 11.37,22.3 12.24,22.3 Q1.3 ; U1.3 6.3,54.09 R1.1 5.53,53.27 C3.2 6.42,51.08 6.62,50.88 v1(6.62,49.56)
  Bottom Layer w0.203: v1(8.02,26.67) 6.62,28.07 v1(6.62,49.56)
I2C_SCL: length 34.9
  Top Layer w0.203: FPC1.6 35.98,47.13 v1(35.96,47.15) ; v1(21.68,44.38) 14.47,44.38 11.11,47.74 U1.8 6.27,47.74 R15.2
  Bottom Layer w0.203: v1(21.68,44.38) 28.74,44.38 31.51,47.15 v1(35.96,47.15)
I2C_SDA: length 34.8
  Top Layer w0.203: R16.2 8.78,46.38 ; 8.78,46.38 U1.9 ; 8.78,46.38 11.07,46.38 14.03,43.41 21.71,43.41 v1(21.73,43.44) ; v1(35.98,46.21) 36.4,46.63 FPC1.5
  Bottom Layer w0.203: v1(35.98,46.21) 35.85,46.33 31.66,46.33 28.77,43.44 v1(21.73,43.44)
IO0: length 2.8
  Top Layer w0.203: U1.25 27.91,40.12 28.16,40.36 29.5,40.36 D4.1
IO0_IO2: length 31.2
  Top Layer w0.203: Q2.3 11.8,28.35 12.44,28.99 30.9,28.99 31.78,29.87 D4.3
IO2: length 25.2
  Top Layer w0.203: 38.45,27.59 37.58,27.59 37.3,27.31 37.3,26.72 37.14,26.56 v1(36.66,26.56) R11.2 ; v1(29.5,37.42) 29.51,37.43 D4.2 29.45,38.38 27.7,38.38 27.24,38.85 U1.24
  Bottom Layer w0.203: v1(36.66,26.56) 36.66,27.58 36.67,27.59 36.44,27.82 30.42,27.82 29.5,28.73 v1(29.5,37.42)
IO5: length 15.2
  Top Layer w0.203: v1(38.6,49.15) 38.6,49.53 38.5,49.64 37.51,49.64 FPC1.11 ; v1(29.71,47.53) 29.71,46.94 27.97,45.2 U1.29
  Bottom Layer w0.203: 38.6,49.23 31.33,49.23 29.71,47.6
IO12: length 49.7
  Top Layer w0.203: v1(7.2,40.11) 8.86,40.11 U1.14 ; U4.2 26.81,10.39 26.18,11.02 17.19,11.02 11.93,16.29 9.64,16.29 8.9,17.02 v1(8.9,22.3)
  Bottom Layer w0.203: v1(8.9,22.3) 8.9,26.78 7.2,28.48 v1(7.2,40.11)
IO14: length 42.9
  Top Layer w0.203: R13.1 v1(36.66,29.1) 37.25,29.7 38.35,29.7 38.45,29.79 ; v1(30.98,30.23) 10.86,30.23 10.45,30.64 10.45,41 10.07,41.39 U1.13
  Bottom Layer w0.203: v1(30.98,30.23) 36.31,30.23 36.66,29.88 v1(36.66,29.1)
IO15: length 18.4
  Top Layer w0.203: U1.23 28.15,37.58 28.34,37.39 28.34,37.22 28.79,36.76 v1(31.03,36.76) ; 38.45,31.99 38.34,31.88 37.12,31.88 v1(36.87,31.63) 35.23,31.63 R12.1
  Bottom Layer w0.203: v1(31.03,36.76) 31.03,33.73 31.59,33.18 36.49,33.18 36.87,32.8 v1(36.87,31.63)
IO18: length 14.6
  Top Layer w0.203: v1(29.12,48.75) 29.12,47.62 27.97,46.47 U1.30 ; R10.2 35.45,50.07 v1(35.68,49.84) 35.68,49.33 35.88,49.13 FPC1.10
  Bottom Layer w0.203: v1(29.12,48.75) 30.22,49.84 v1(35.68,49.84)
IO19: length 15.1
  Top Layer w0.203: v1(36.06,51.52) 36.06,50.55 36.48,50.13 FPC1.12 ; U1.31 28.1,47.74 28.11,47.73 28.46,48.09 v1(28.46,49.66)
  Bottom Layer w0.203: v1(28.46,49.66) 28.46,51.06 28.89,51.49 36.03,51.49 v1(36.06,51.52)
IO21: length 18.1
  Top Layer w0.203: v1(30.65,47.5) 30.65,49.25 29.63,50.28 U1.33 ; FPC1.4 38.84,46.13 39.13,46.42 39.13,47.93 38.94,48.13 FPC1.8 36.45,48.13 v1(36.29,47.96)
  Bottom Layer w0.203: v1(36.29,47.96) 36.24,47.91 31.61,47.91 31.21,47.5 v1(30.65,47.5)
IO22: length 20.3
  Top Layer w0.203: R5.1 34.48,55.48 34.13,55.83 30.82,55.83 29.81,56.85 v1(29.81,58.53) 32.15,58.53 ; 32.15,58.53 32.16,58.54 Q3.1 32.91,58.53 32.15,58.53 ; U1.36 v1(28.72,54.09)
  Bottom Layer w0.203: v1(28.72,54.09) 28.72,57.99 29.25,58.53 v1(29.81,58.53)
IO23: length 27.8
  Top Layer w0.203: U1.37 26.91,55.4 v1(30.47,55.4) ; FPC1.9 37.47,48.59 v1(35.7,48.59) 34.87,47.76 R6.2
  Bottom Layer w0.203: v1(30.47,55.4) 36.16,55.4 37.05,54.51 40.25,54.51 40.71,54.05 40.71,49.31 39.99,48.59 v1(35.7,48.59)
IO25: length 44.1
  Top Layer w0.203: U1.10 8.9,45.16 v1(10.89,45.16)
  Bottom Layer w0.203: 35.81,21.84 35.81,23.98 34.61,25.18 30.16,25.18 29.48,25.86 29.48,26.72 28.11,28.1 25.77,28.1 25.21,28.66 25.21,32.92 23.79,34.34 16.14,34.34 14.42,36.07 14.42,38.59 10.89,42.12 v1(10.89,45.16)
IO26: length 47.7
  Top Layer w0.203: U1.11 11.42,43.93 v1(11.44,43.95)
  Bottom Layer w0.203: H1.5 40.89,23.06 40.07,23.88 38.45,23.88 36.54,25.79 30.42,25.79 30.09,26.11 30.09,26.98 28.36,28.71 26.02,28.71 25.82,28.91 25.82,33.17 24.04,34.95 16.4,34.95 15.03,36.33 15.03,38.84 12.46,41.4 12.46,43.64 12.16,43.94 11.45,43.94 v1(11.44,43.95)
IO27: length 44.1
  Top Layer w0.203: U1.12 8.87,42.65 v1(11.88,42.65)
  Bottom Layer w0.203: v1(11.88,42.65) 11.88,41.56 14.72,38.71 14.72,36.2 16.27,34.65 23.91,34.65 25.52,33.05 25.52,28.78 25.9,28.4 28.23,28.4 29.78,26.85 29.78,25.99 30.29,25.48 36.19,25.48 38.35,23.32 H1.6
RTS: length 8.3
  Top Layer w0.203: Q1.2 17.58,20.09 R2.1 17.98,20.16 U2.14
RXD0: length 39.4
  Top Layer w0.254: U1.34 23.95,51.55 23.36,50.96 v1(23.36,31.12) ; v1(23.36,28.27) 23.38,28.25 23.38,19.46 23.95,18.89 U2.2
  Bottom Layer w0.254: v1(23.36,31.12) v1(23.36,28.27)
TP_INT: length 3
  Top Layer w0.203: FPC1.3 37.5,45.62 R7.2
TXD0: length 38.1
  Top Layer w0.254: v1(24.22,31.17) v1(24.22,50.32) ; U1.35 26.81,52.76 v1(24.22,52.76) ; v1(24.19,28.22) 24.19,20.7 24.74,20.16 U2.3
  Bottom Layer w0.254: v1(24.22,31.17) 24.22,28.25 v1(24.19,28.22) ; v1(24.22,50.32) v1(24.22,52.76)
$1N3592: length 12.3
  Top Layer w0.203: Q1.1 11.57,20.15 11.57,20.86 11.88,21.16 12.99,21.16 13.35,21.52 13.35,22.36 13.81,22.81 14.95,22.81 15.33,23.19 15.33,26.67 15.81,27.16 17.92,27.16 R17.2
$1N3593: length 9.2
  Top Layer w0.203: Q2.1 10.85,24.63 v1(11.77,23.7) ; R2.2 17.82,23.4 17.52,23.7 v1(16.17,23.7)
  Bottom Layer w0.203: v1(16.17,23.7) v1(11.77,23.7)
$1N3615: length 7.2
  Top Layer w0.203: Q3.3 35.9,57.59 36.11,57.38 36.11,52.99 36.47,52.63 FPC1.17

## Copper pours and planes (outline as drawn; the poured copper is in the pictures)
3V3 on Top Layer: 29.28,32.66 34.01,32.66 34.01,20.73 29.28,20.73
3V3 on Top Layer: 26.38,21.91 30.9,21.91 30.9,21.05 26.38,21.05
3V3 on Top Layer: 17.49,18.22 22.54,18.22 22.54,17.28 17.49,17.28
3V3 on Top Layer: 36.9,52.28 39.74,52.28 39.74,51.46 36.9,51.46
3V3 on Top Layer: 31.76,54.1 33.01,54.1 33.01,43.46 31.76,43.46
GND on Top Layer: -20.5,88.85 86.56,88.85 86.56,-23.47 -20.5,-23.47
GND on Bottom Layer: -11.11,80.26 78.25,80.26 78.25,-14.33 -11.11,-14.33
VBUS on Top Layer: 11.98,7.32 12.94,7.32 12.94,4.12 11.98,4.12

## Text on the board
Top Silkscreen Layer: IO25 | IO27 | IO26 | 3V3
